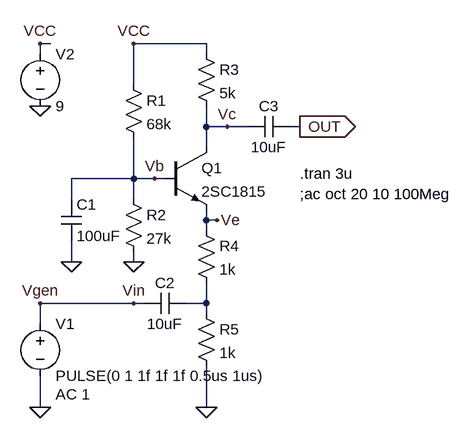
[diagram p0: schematic BaseCommon_Step.asc]
BaseCommon_Step.asc, the LTspice schematic file:
Version 4
SHEET 1 880 680
WIRE 16 -64 0 -64
WIRE 256 -64 144 -64
WIRE 0 -48 0 -64
WIRE 256 -48 256 -64
WIRE 144 0 144 -64
WIRE 256 64 256 32
WIRE 288 64 256 64
WIRE 320 64 288 64
WIRE 400 64 384 64
WIRE 256 96 256 64
WIRE 144 144 144 80
WIRE 144 144 48 144
WIRE 176 144 144 144
WIRE 192 144 176 144
WIRE 48 176 48 144
WIRE 144 176 144 144
WIRE 256 208 256 192
WIRE 272 208 256 208
WIRE 256 224 256 208
WIRE 48 272 48 240
WIRE 144 272 144 256
WIRE 144 336 0 336
WIRE 160 336 144 336
WIRE 256 336 256 304
WIRE 256 336 224 336
WIRE 256 352 256 336
WIRE 0 368 0 336
WIRE 0 496 0 448
WIRE 256 496 256 432
FLAG 144 272 0
FLAG 48 272 0
FLAG 256 496 0
FLAG 0 496 0
FLAG 0 336 Vgen
FLAG 400 64 OUT
IOPIN 400 64 Out
FLAG 0 32 0
FLAG 0 -64 VCC
FLAG 144 -64 VCC
FLAG 176 144 Vb
FLAG 144 336 Vin
FLAG 272 208 Ve
FLAG 288 64 Vc
SYMBOL npn 192 96 R0
SYMATTR InstName Q1
SYMATTR Value 2SC1815
SYMBOL res 128 -16 R0
SYMATTR InstName R1
SYMATTR Value 68k
SYMBOL res 128 160 R0
SYMATTR InstName R2
SYMATTR Value 27k
SYMBOL cap 32 176 R0
SYMATTR InstName C1
SYMATTR Value 100uF
SYMBOL res 240 -64 R0
SYMATTR InstName R3
SYMATTR Value 5k
SYMBOL res 240 208 R0
SYMATTR InstName R4
SYMATTR Value 1k
SYMBOL res 240 336 R0
SYMATTR InstName R5
SYMATTR Value 1k
SYMBOL cap 224 320 R90
WINDOW 0 0 32 VBottom 2
WINDOW 3 32 32 VTop 2
SYMATTR InstName C2
SYMATTR Value 10uF
SYMBOL voltage 0 352 R0
WINDOW 123 24 124 Left 2
WINDOW 39 24 152 Left 2
SYMATTR Value2 AC 1
SYMATTR InstName V1
SYMATTR Value PULSE(0 1 1f 1f 1f 0.5us 1us)
SYMBOL voltage 0 -64 R0
SYMATTR InstName V2
SYMATTR Value 9
SYMBOL cap 384 48 R90
WINDOW 0 0 32 VBottom 2
WINDOW 3 32 32 VTop 2
SYMATTR InstName C3
SYMATTR Value 10uF
TEXT 400 136 Left 2 !.tran 3u
TEXT 400 168 Left 2 !;ac oct 20 10 100Meg

The netlist it stands for:
* BaseCommon_Step.asc
Q1 Vc Vb Ve 0 2SC1815
R1 VCC Vb 68k
R2 Vb 0 27k
C1 Vb 0 100uF
R3 VCC Vc 5k
R4 Ve N001 1k
R5 N001 0 1k
C2 N001 Vin 10uF
V1 Vin 0 PULSE(0 1 1f 1f 1f 0.5us 1us) AC 1
V2 VCC 0 9
C3 OUT Vc 10uF
.model NPN NPN
.model PNP PNP
.lib standard.bjt
.tran 3u
;ac oct 20 10 100Meg
.backanno
.end